# Altium project SCH-29364_a.PrjPcb (part 3 of 3)

## Sheet X-02 IOMUX.SchDoc
size 513 x 386 mm
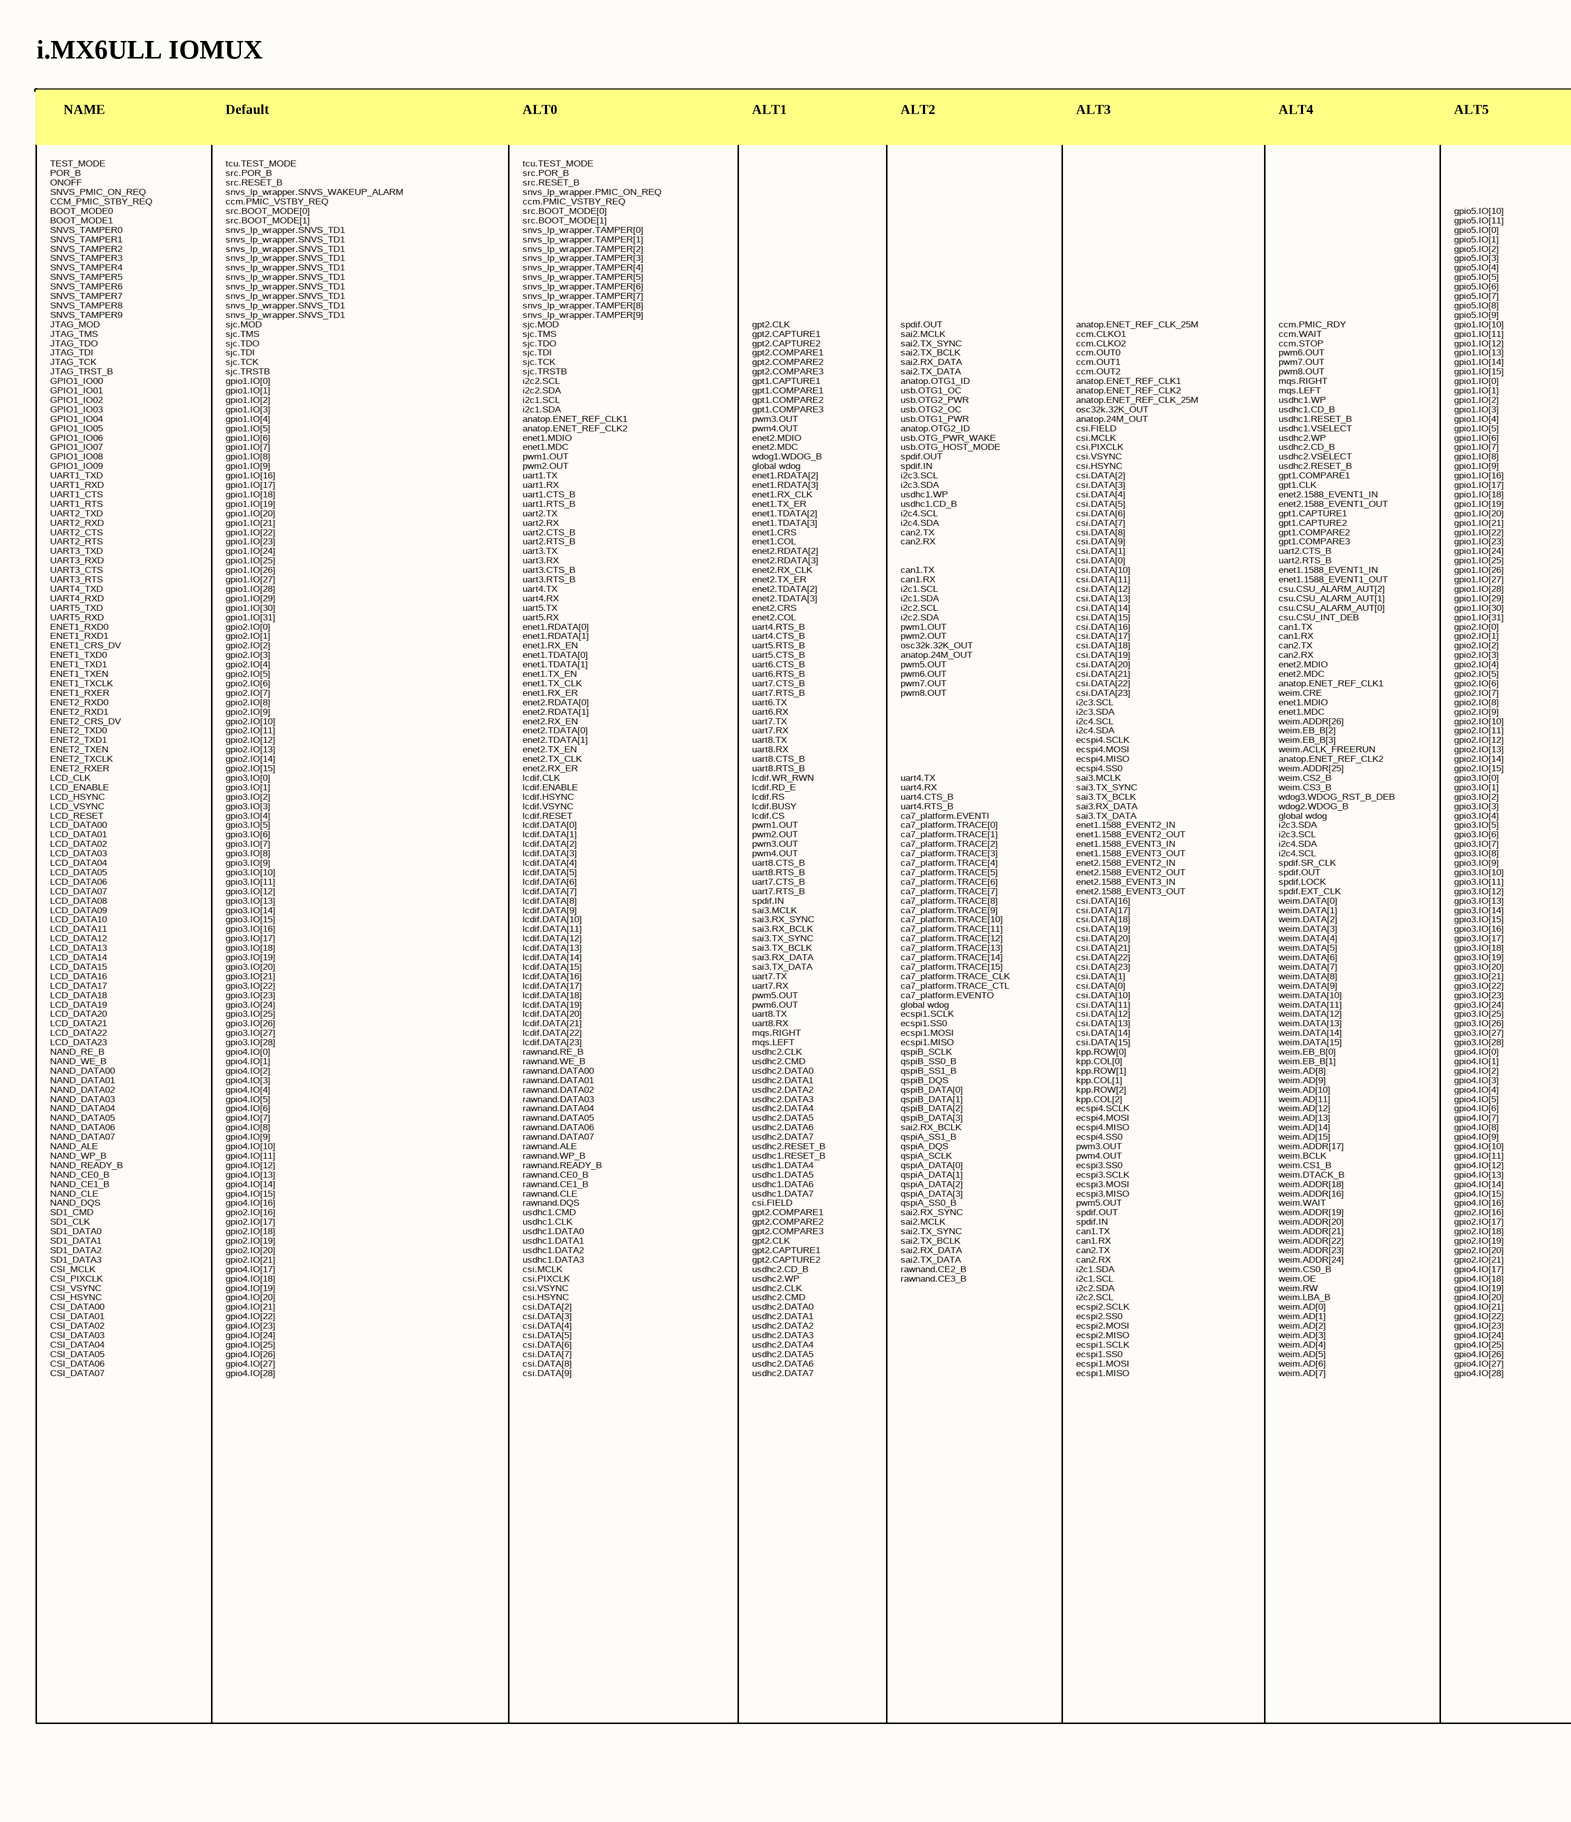
[diagram p20: X-02 IOMUX.SchDoc, left]
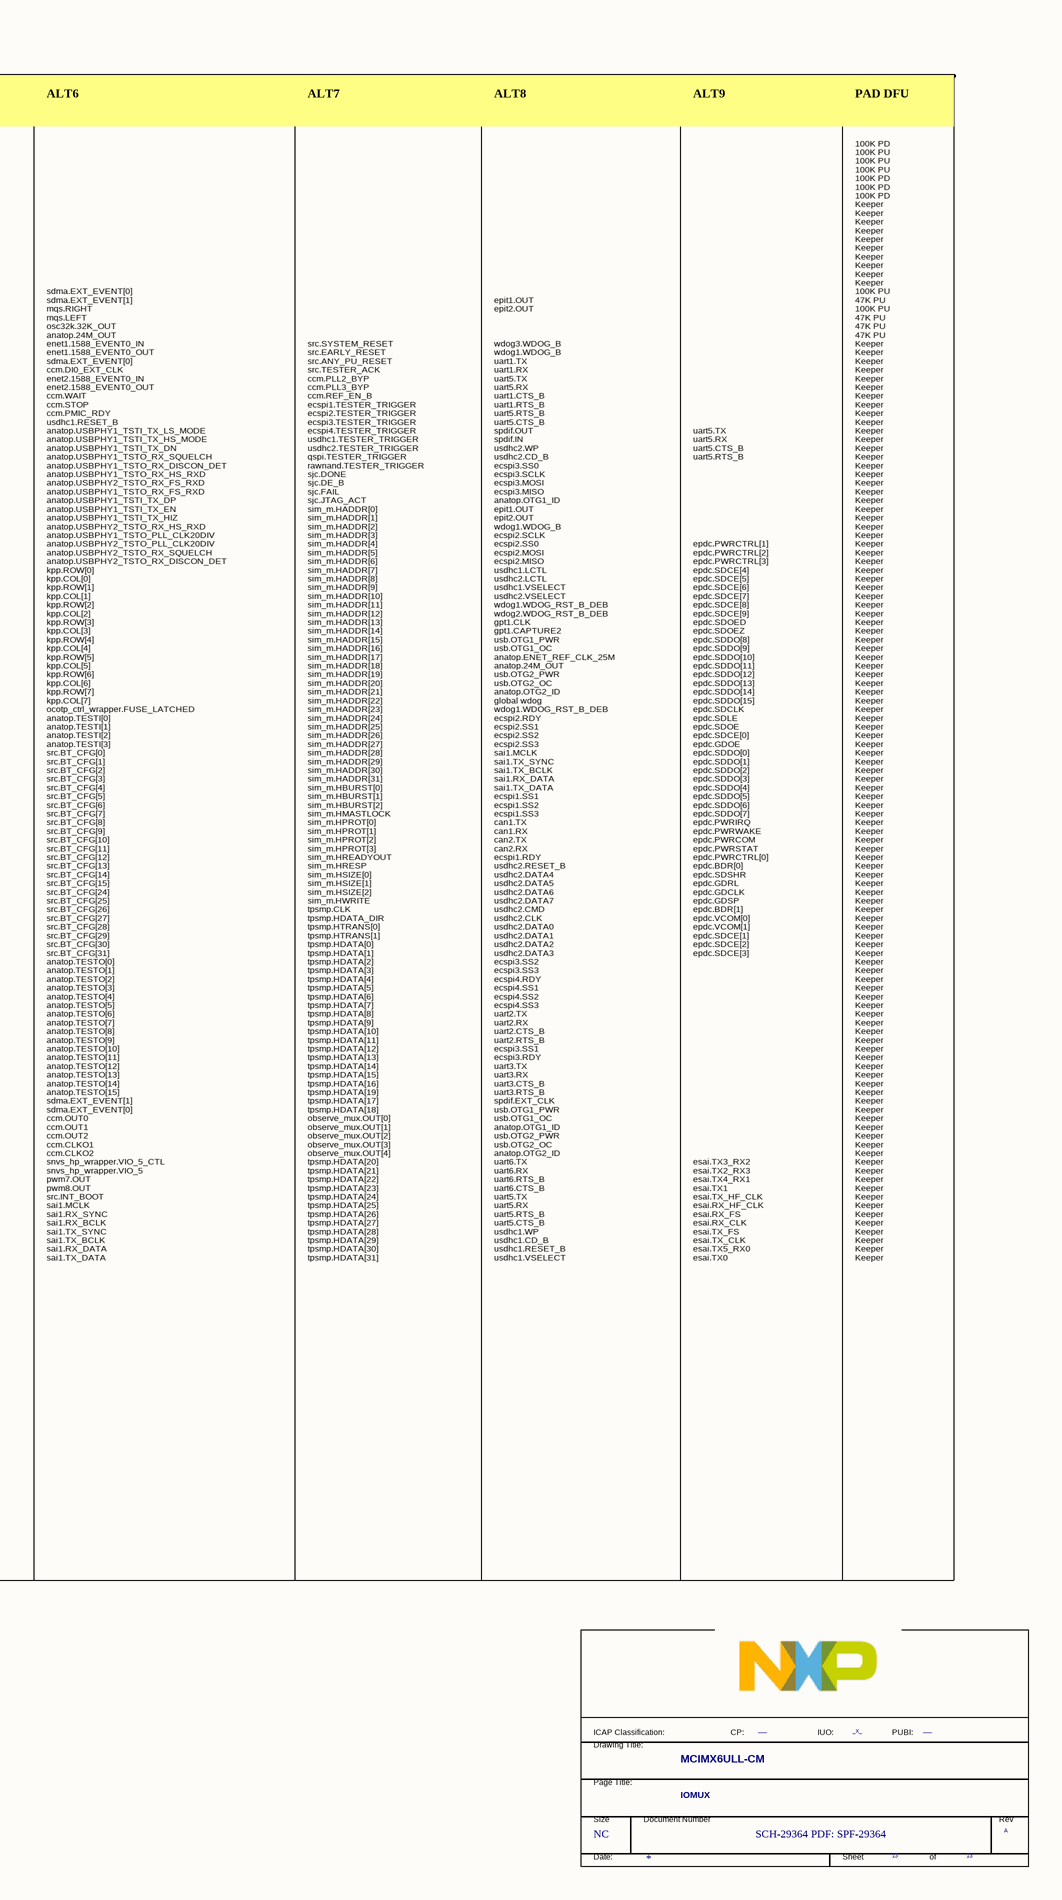
[diagram p21: X-02 IOMUX.SchDoc, right]

### Parts
(Parts that share a designator on the sheet are numbered #1, #2 ... from top to bottom, then left to right.)
*#12  FIUO: _X_  PUBI: ___  Doc: SCH-29364 PDF: SPF-29364  RevCode: A  Title: MCIMX6ULL-CM  Page Size: NC  Page Number: 13  PageTitle: IOMUX  (hidden comment: TitleBlock_FS)  (graphical)

### Notes on the sheet
- i.MX6ULL IOMUX
- NAME
- Default
- ALT0
- ALT1
- ALT2
- ALT3
- ALT4
- ALT5
- ALT6
- ALT7
- ALT8
- ALT9
- PAD DFU
- TEST_MODE
  POR_B
  ONOFF
  SNVS_PMIC_ON_REQ
  CCM_PMIC_STBY_REQ
  BOOT_MODE0
  BOOT_MODE1
  SNVS_TAMPER0
  SNVS_TAMPER1
  SNVS_TAMPER2
  SNVS_TAMPER3
  SNVS_TAMPER4
  SNVS_TAMPER5
  SNVS_TAMPER6
  SNVS_TAMPER7
  SNVS_TAMPER8
  SNVS_TAMPER9
  JTAG_MOD
  JTAG_TMS
  JTAG_TDO
  JTAG_TDI
  JTAG_TCK
  JTAG_TRST_B
  GPIO1_IO00
  GPIO1_IO01
  GPIO1_IO02
  GPIO1_IO03
  GPIO1_IO04
  GPIO1_IO05
  GPIO1_IO06
  GPIO1_IO07
  GPIO1_IO08
  GPIO1_IO09
  UART1_TXD
  UART1_RXD
  UART1_CTS
  UART1_RTS
  UART2_TXD
  UART2_RXD
  UART2_CTS
  UART2_RTS
  UART3_TXD
  UART3_RXD
  UART3_CTS
  UART3_RTS
  UART4_TXD
  UART4_RXD
  UART5_TXD
  UART5_RXD
  ENET1_RXD0
  ENET1_RXD1
  ENET1_CRS_DV
  ENET1_TXD0
  ENET1_TXD1
  ENET1_TXEN
  ENET1_TXCLK
  ENET1_RXER
  ENET2_RXD0
  ENET2_RXD1
  ENET2_CRS_DV
  ENET2_TXD0
  ENET2_TXD1
  ENET2_TXEN
  ENET2_TXCLK
  ENET2_RXER
  LCD_CLK
  LCD_ENABLE
  LCD_HSYNC
  LCD_VSYNC
  LCD_RESET
  LCD_DATA00
  LCD_DATA01
  LCD_DATA02
  LCD_DATA03
  LCD_DATA04
  LCD_DATA05
  LCD_DATA06
  LCD_DATA07
  LCD_DATA08
  LCD_DATA09
  LCD_DATA10
  LCD_DATA11
  LCD_DATA12
  LCD_DATA13
  LCD_DATA14
  LCD_DATA15
  LCD_DATA16
  LCD_DATA17
  LCD_DATA18
  LCD_DATA19
  LCD_DATA20
  LCD_DATA21
  LCD_DATA22
  LCD_DATA23
  NAND_RE_B
  NAND_WE_B
  NAND_DATA00
  NAND_DATA01
  NAND_DATA02
  NAND_DATA03
  NAND_DATA04
  NAND_DATA05
  NAND_DATA06
  NAND_DATA07
  NAND_ALE
  NAND_WP_B
  NAND_READY_B
  NAND_CE0_B
  NAND_CE1_B
  NAND_CLE
  NAND_DQS
  SD1_CMD
  SD1_CLK
  SD1_DATA0
  SD1_DATA1
  SD1_DATA2
  SD1_DATA3
  CSI_MCLK
  CSI_PIXCLK
  CSI_VSYNC
  CSI_HSYNC
  CSI_DATA00
  CSI_DATA01
  CSI_DATA02
  CSI_DATA03
  CSI_DATA04
  CSI_DATA05
  CSI_DATA06
  CSI_DATA07
- tcu.TEST_MODE
  src.POR_B
  src.RESET_B
  snvs_lp_wrapper.SNVS_WAKEUP_ALARM
  ccm.PMIC_VSTBY_REQ
  src.BOOT_MODE[0]
  src.BOOT_MODE[1]
  snvs_lp_wrapper.SNVS_TD1
  snvs_lp_wrapper.SNVS_TD1
  snvs_lp_wrapper.SNVS_TD1
  snvs_lp_wrapper.SNVS_TD1
  snvs_lp_wrapper.SNVS_TD1
  snvs_lp_wrapper.SNVS_TD1
  snvs_lp_wrapper.SNVS_TD1
  snvs_lp_wrapper.SNVS_TD1
  snvs_lp_wrapper.SNVS_TD1
  snvs_lp_wrapper.SNVS_TD1
  sjc.MOD
  sjc.TMS
  sjc.TDO
  sjc.TDI
  sjc.TCK
  sjc.TRSTB
  gpio1.IO[0]
  gpio1.IO[1]
  gpio1.IO[2]
  gpio1.IO[3]
  gpio1.IO[4]
  gpio1.IO[5]
  gpio1.IO[6]
  gpio1.IO[7]
  gpio1.IO[8]
  gpio1.IO[9]
  gpio1.IO[16]
  gpio1.IO[17]
  gpio1.IO[18]
  gpio1.IO[19]
  gpio1.IO[20]
  gpio1.IO[21]
  gpio1.IO[22]
  gpio1.IO[23]
  gpio1.IO[24]
  gpio1.IO[25]
  gpio1.IO[26]
  gpio1.IO[27]
  gpio1.IO[28]
  gpio1.IO[29]
  gpio1.IO[30]
  gpio1.IO[31]
  gpio2.IO[0]
  gpio2.IO[1]
  gpio2.IO[2]
  gpio2.IO[3]
  gpio2.IO[4]
  gpio2.IO[5]
  gpio2.IO[6]
  gpio2.IO[7]
  gpio2.IO[8]
  gpio2.IO[9]
  gpio2.IO[10]
  gpio2.IO[11]
  gpio2.IO[12]
  gpio2.IO[13]
  gpio2.IO[14]
  gpio2.IO[15]
  gpio3.IO[0]
  gpio3.IO[1]
  gpio3.IO[2]
  gpio3.IO[3]
  gpio3.IO[4]
  gpio3.IO[5]
  gpio3.IO[6]
  gpio3.IO[7]
  gpio3.IO[8]
  gpio3.IO[9]
  gpio3.IO[10]
  gpio3.IO[11]
  gpio3.IO[12]
  gpio3.IO[13]
  gpio3.IO[14]
  gpio3.IO[15]
  gpio3.IO[16]
  gpio3.IO[17]
  gpio3.IO[18]
  gpio3.IO[19]
  gpio3.IO[20]
  gpio3.IO[21]
  gpio3.IO[22]
  gpio3.IO[23]
  gpio3.IO[24]
  gpio3.IO[25]
  gpio3.IO[26]
  gpio3.IO[27]
  gpio3.IO[28]
  gpio4.IO[0]
  gpio4.IO[1]
  gpio4.IO[2]
  gpio4.IO[3]
  gpio4.IO[4]
  gpio4.IO[5]
  gpio4.IO[6]
  gpio4.IO[7]
  gpio4.IO[8]
  gpio4.IO[9]
  gpio4.IO[10]
  gpio4.IO[11]
  gpio4.IO[12]
  gpio4.IO[13]
  gpio4.IO[14]
  gpio4.IO[15]
  gpio4.IO[16]
  gpio2.IO[16]
  gpio2.IO[17]
  gpio2.IO[18]
  gpio2.IO[19]
  gpio2.IO[20]
  gpio2.IO[21]
  gpio4.IO[17]
  gpio4.IO[18]
  gpio4.IO[19]
  gpio4.IO[20]
  gpio4.IO[21]
  gpio4.IO[22]
  gpio4.IO[23]
  gpio4.IO[24]
  gpio4.IO[25]
  gpio4.IO[26]
  gpio4.IO[27]
  gpio4.IO[28]
- tcu.TEST_MODE
  src.POR_B
  src.RESET_B
  snvs_lp_wrapper.PMIC_ON_REQ
  ccm.PMIC_VSTBY_REQ
  src.BOOT_MODE[0]
  src.BOOT_MODE[1]
  snvs_lp_wrapper.TAMPER[0]
  snvs_lp_wrapper.TAMPER[1]
  snvs_lp_wrapper.TAMPER[2]
  snvs_lp_wrapper.TAMPER[3]
  snvs_lp_wrapper.TAMPER[4]
  snvs_lp_wrapper.TAMPER[5]
  snvs_lp_wrapper.TAMPER[6]
  snvs_lp_wrapper.TAMPER[7]
  snvs_lp_wrapper.TAMPER[8]
  snvs_lp_wrapper.TAMPER[9]
  sjc.MOD
  sjc.TMS
  sjc.TDO
  sjc.TDI
  sjc.TCK
  sjc.TRSTB
  i2c2.SCL
  i2c2.SDA
  i2c1.SCL
  i2c1.SDA
  anatop.ENET_REF_CLK1
  anatop.ENET_REF_CLK2
  enet1.MDIO
  enet1.MDC
  pwm1.OUT
  pwm2.OUT
  uart1.TX
  uart1.RX
  uart1.CTS_B
  uart1.RTS_B
  uart2.TX
  uart2.RX
  uart2.CTS_B
  uart2.RTS_B
  uart3.TX
  uart3.RX
  uart3.CTS_B
  uart3.RTS_B
  uart4.TX
  uart4.RX
  uart5.TX
  uart5.RX
  enet1.RDATA[0]
  enet1.RDATA[1]
  enet1.RX_EN
  enet1.TDATA[0]
  enet1.TDATA[1]
  enet1.TX_EN
  enet1.TX_CLK
  enet1.RX_ER
  enet2.RDATA[0]
  enet2.RDATA[1]
  enet2.RX_EN
  enet2.TDATA[0]
  enet2.TDATA[1]
  enet2.TX_EN
  enet2.TX_CLK
  enet2.RX_ER
  lcdif.CLK
  lcdif.ENABLE
  lcdif.HSYNC
  lcdif.VSYNC
  lcdif.RESET
  lcdif.DATA[0]
  lcdif.DATA[1]
  lcdif.DATA[2]
  lcdif.DATA[3]
  lcdif.DATA[4]
  lcdif.DATA[5]
  lcdif.DATA[6]
  lcdif.DATA[7]
  lcdif.DATA[8]
  lcdif.DATA[9]
  lcdif.DATA[10]
  lcdif.DATA[11]
  lcdif.DATA[12]
  lcdif.DATA[13]
  lcdif.DATA[14]
  lcdif.DATA[15]
  lcdif.DATA[16]
  lcdif.DATA[17]
  lcdif.DATA[18]
  lcdif.DATA[19]
  lcdif.DATA[20]
  lcdif.DATA[21]
  lcdif.DATA[22]
  lcdif.DATA[23]
  rawnand.RE_B
  rawnand.WE_B
  rawnand.DATA00
  rawnand.DATA01
  rawnand.DATA02
  rawnand.DATA03
  rawnand.DATA04
  rawnand.DATA05
  rawnand.DATA06
  rawnand.DATA07
  rawnand.ALE
  rawnand.WP_B
  rawnand.READY_B
  rawnand.CE0_B
  rawnand.CE1_B
  rawnand.CLE
  rawnand.DQS
  usdhc1.CMD
  usdhc1.CLK
  usdhc1.DATA0
  usdhc1.DATA1
  usdhc1.DATA2
  usdhc1.DATA3
  csi.MCLK
  csi.PIXCLK
  csi.VSYNC
  csi.HSYNC
  csi.DATA[2]
  csi.DATA[3]
  csi.DATA[4]
  csi.DATA[5]
  csi.DATA[6]
  csi.DATA[7]
  csi.DATA[8]
  csi.DATA[9]
- gpt2.CLK
  gpt2.CAPTURE1
  gpt2.CAPTURE2
  gpt2.COMPARE1
  gpt2.COMPARE2
  gpt2.COMPARE3
  gpt1.CAPTURE1
  gpt1.COMPARE1
  gpt1.COMPARE2
  gpt1.COMPARE3
  pwm3.OUT
  pwm4.OUT
  enet2.MDIO
  enet2.MDC
  wdog1.WDOG_B
  global wdog
  enet1.RDATA[2]
  enet1.RDATA[3]
  enet1.RX_CLK
  enet1.TX_ER
  enet1.TDATA[2]
  enet1.TDATA[3]
  enet1.CRS
  enet1.COL
  enet2.RDATA[2]
  enet2.RDATA[3]
  enet2.RX_CLK
  enet2.TX_ER
  enet2.TDATA[2]
  enet2.TDATA[3]
  enet2.CRS
  enet2.COL
  uart4.RTS_B
  uart4.CTS_B
  uart5.RTS_B
  uart5.CTS_B
  uart6.CTS_B
  uart6.RTS_B
  uart7.CTS_B
  uart7.RTS_B
  uart6.TX
  uart6.RX
  uart7.TX
  uart7.RX
  uart8.TX
  uart8.RX
  uart8.CTS_B
  uart8.RTS_B
  lcdif.WR_RWN
  lcdif.RD_E
  lcdif.RS
  lcdif.BUSY
  lcdif.CS
  pwm1.OUT
  pwm2.OUT
  pwm3.OUT
  pwm4.OUT
  uart8.CTS_B
  uart8.RTS_B
  uart7.CTS_B
  uart7.RTS_B
  spdif.IN
  sai3.MCLK
  sai3.RX_SYNC
  sai3.RX_BCLK
  sai3.TX_SYNC
  sai3.TX_BCLK
  sai3.RX_DATA
  sai3.TX_DATA
  uart7.TX
  uart7.RX
  pwm5.OUT
  pwm6.OUT
  uart8.TX
  uart8.RX
  mqs.RIGHT
  mqs.LEFT
  usdhc2.CLK
  usdhc2.CMD
  usdhc2.DATA0
  usdhc2.DATA1
  usdhc2.DATA2
  usdhc2.DATA3
  usdhc2.DATA4
  usdhc2.DATA5
  usdhc2.DATA6
  usdhc2.DATA7
  usdhc2.RESET_B
  usdhc1.RESET_B
  usdhc1.DATA4
  usdhc1.DATA5
  usdhc1.DATA6
  usdhc1.DATA7
  csi.FIELD
  gpt2.COMPARE1
  gpt2.COMPARE2
  gpt2.COMPARE3
  gpt2.CLK
  gpt2.CAPTURE1
  gpt2.CAPTURE2
  usdhc2.CD_B
  usdhc2.WP
  usdhc2.CLK
  usdhc2.CMD
  usdhc2.DATA0
  usdhc2.DATA1
  usdhc2.DATA2
  usdhc2.DATA3
  usdhc2.DATA4
  usdhc2.DATA5
  usdhc2.DATA6
  usdhc2.DATA7
- spdif.OUT
  sai2.MCLK
  sai2.TX_SYNC
  sai2.TX_BCLK
  sai2.RX_DATA
  sai2.TX_DATA
  anatop.OTG1_ID
  usb.OTG1_OC
  usb.OTG2_PWR
  usb.OTG2_OC
  usb.OTG1_PWR
  anatop.OTG2_ID
  usb.OTG_PWR_WAKE
  usb.OTG_HOST_MODE
  spdif.OUT
  spdif.IN
  i2c3.SCL
  i2c3.SDA
  usdhc1.WP
  usdhc1.CD_B
  i2c4.SCL
  i2c4.SDA
  can2.TX
  can2.RX
  can1.TX
  can1.RX
  i2c1.SCL
  i2c1.SDA
  i2c2.SCL
  i2c2.SDA
  pwm1.OUT
  pwm2.OUT
  osc32k.32K_OUT
  anatop.24M_OUT
  pwm5.OUT
  pwm6.OUT
  pwm7.OUT
  pwm8.OUT
  uart4.TX
  uart4.RX
  uart4.CTS_B
  uart4.RTS_B
  ca7_platform.EVENTI
  ca7_platform.TRACE[0]
  ca7_platform.TRACE[1]
  ca7_platform.TRACE[2]
  ca7_platform.TRACE[3]
  ca7_platform.TRACE[4]
  ca7_platform.TRACE[5]
  ca7_platform.TRACE[6]
  ca7_platform.TRACE[7]
  ca7_platform.TRACE[8]
  ca7_platform.TRACE[9]
  ca7_platform.TRACE[10]
  ca7_platform.TRACE[11]
  ca7_platform.TRACE[12]
  ca7_platform.TRACE[13]
  ca7_platform.TRACE[14]
  ca7_platform.TRACE[15]
  ca7_platform.TRACE_CLK
  ca7_platform.TRACE_CTL
  ca7_platform.EVENTO
  global wdog
  ecspi1.SCLK
  ecspi1.SS0
  ecspi1.MOSI
  ecspi1.MISO
  qspiB_SCLK
  qspiB_SS0_B
  qspiB_SS1_B
  qspiB_DQS
  qspiB_DATA[0]
  qspiB_DATA[1]
  qspiB_DATA[2]
  qspiB_DATA[3]
  sai2.RX_BCLK
  qspiA_SS1_B
  qspiA_DQS
  qspiA_SCLK
  qspiA_DATA[0]
  qspiA_DATA[1]
  qspiA_DATA[2]
  qspiA_DATA[3]
  qspiA_SS0_B
  sai2.RX_SYNC
  sai2.MCLK
  sai2.TX_SYNC
  sai2.TX_BCLK
  sai2.RX_DATA
  sai2.TX_DATA
  rawnand.CE2_B
  rawnand.CE3_B
- anatop.ENET_REF_CLK_25M
  ccm.CLKO1
  ccm.CLKO2
  ccm.OUT0
  ccm.OUT1
  ccm.OUT2
  anatop.ENET_REF_CLK1
  anatop.ENET_REF_CLK2
  anatop.ENET_REF_CLK_25M
  osc32k.32K_OUT
  anatop.24M_OUT
  csi.FIELD
  csi.MCLK
  csi.PIXCLK
  csi.VSYNC
  csi.HSYNC
  csi.DATA[2]
  csi.DATA[3]
  csi.DATA[4]
  csi.DATA[5]
  csi.DATA[6]
  csi.DATA[7]
  csi.DATA[8]
  csi.DATA[9]
  csi.DATA[1]
  csi.DATA[0]
  csi.DATA[10]
  csi.DATA[11]
  csi.DATA[12]
  csi.DATA[13]
  csi.DATA[14]
  csi.DATA[15]
  csi.DATA[16]
  csi.DATA[17]
  csi.DATA[18]
  csi.DATA[19]
  csi.DATA[20]
  csi.DATA[21]
  csi.DATA[22]
  csi.DATA[23]
  i2c3.SCL
  i2c3.SDA
  i2c4.SCL
  i2c4.SDA
  ecspi4.SCLK
  ecspi4.MOSI
  ecspi4.MISO
  ecspi4.SS0
  sai3.MCLK
  sai3.TX_SYNC
  sai3.TX_BCLK
  sai3.RX_DATA
  sai3.TX_DATA
  enet1.1588_EVENT2_IN
  enet1.1588_EVENT2_OUT
  enet1.1588_EVENT3_IN
  enet1.1588_EVENT3_OUT
  enet2.1588_EVENT2_IN
  enet2.1588_EVENT2_OUT
  enet2.1588_EVENT3_IN
  enet2.1588_EVENT3_OUT
  csi.DATA[16]
  csi.DATA[17]
  csi.DATA[18]
  csi.DATA[19]
  csi.DATA[20]
  csi.DATA[21]
  csi.DATA[22]
  csi.DATA[23]
  csi.DATA[1]
  csi.DATA[0]
  csi.DATA[10]
  csi.DATA[11]
  csi.DATA[12]
  csi.DATA[13]
  csi.DATA[14]
  csi.DATA[15]
  kpp.ROW[0]
  kpp.COL[0]
  kpp.ROW[1]
  kpp.COL[1]
  kpp.ROW[2]
  kpp.COL[2]
  ecspi4.SCLK
  ecspi4.MOSI
  ecspi4.MISO
  ecspi4.SS0
  pwm3.OUT
  pwm4.OUT
  ecspi3.SS0
  ecspi3.SCLK
  ecspi3.MOSI
  ecspi3.MISO
  pwm5.OUT
  spdif.OUT
  spdif.IN
  can1.TX
  can1.RX
  can2.TX
  can2.RX
  i2c1.SDA
  i2c1.SCL
  i2c2.SDA
  i2c2.SCL
  ecspi2.SCLK
  ecspi2.SS0
  ecspi2.MOSI
  ecspi2.MISO
  ecspi1.SCLK
  ecspi1.SS0
  ecspi1.MOSI
  ecspi1.MISO
- ccm.PMIC_RDY
  ccm.WAIT
  ccm.STOP
  pwm6.OUT
  pwm7.OUT
  pwm8.OUT
  mqs.RIGHT
  mqs.LEFT
  usdhc1.WP
  usdhc1.CD_B
  usdhc1.RESET_B
  usdhc1.VSELECT
  usdhc2.WP
  usdhc2.CD_B
  usdhc2.VSELECT
  usdhc2.RESET_B
  gpt1.COMPARE1
  gpt1.CLK
  enet2.1588_EVENT1_IN
  enet2.1588_EVENT1_OUT
  gpt1.CAPTURE1
  gpt1.CAPTURE2
  gpt1.COMPARE2
  gpt1.COMPARE3
  uart2.CTS_B
  uart2.RTS_B
  enet1.1588_EVENT1_IN
  enet1.1588_EVENT1_OUT
  csu.CSU_ALARM_AUT[2]
  csu.CSU_ALARM_AUT[1]
  csu.CSU_ALARM_AUT[0]
  csu.CSU_INT_DEB
  can1.TX
  can1.RX
  can2.TX
  can2.RX
  enet2.MDIO
  enet2.MDC
  anatop.ENET_REF_CLK1
  weim.CRE
  enet1.MDIO
  enet1.MDC
  weim.ADDR[26]
  weim.EB_B[2]
  weim.EB_B[3]
  weim.ACLK_FREERUN
  anatop.ENET_REF_CLK2
  weim.ADDR[25]
  weim.CS2_B
  weim.CS3_B
  wdog3.WDOG_RST_B_DEB
  wdog2.WDOG_B
  global wdog
  i2c3.SDA
  i2c3.SCL
  i2c4.SDA
  i2c4.SCL
  spdif.SR_CLK
  spdif.OUT
  spdif.LOCK
  spdif.EXT_CLK
  weim.DATA[0]
  weim.DATA[1]
  weim.DATA[2]
  weim.DATA[3]
  weim.DATA[4]
  weim.DATA[5]
  weim.DATA[6]
  weim.DATA[7]
  weim.DATA[8]
  weim.DATA[9]
  weim.DATA[10]
  weim.DATA[11]
  weim.DATA[12]
  weim.DATA[13]
  weim.DATA[14]
  weim.DATA[15]
  weim.EB_B[0]
  weim.EB_B[1]
  weim.AD[8]
  weim.AD[9]
  weim.AD[10]
  weim.AD[11]
  weim.AD[12]
  weim.AD[13]
  weim.AD[14]
  weim.AD[15]
  weim.ADDR[17]
  weim.BCLK
  weim.CS1_B
  weim.DTACK_B
  weim.ADDR[18]
  weim.ADDR[16]
  weim.WAIT
  weim.ADDR[19]
  weim.ADDR[20]
  weim.ADDR[21]
  weim.ADDR[22]
  weim.ADDR[23]
  weim.ADDR[24]
  weim.CS0_B
  weim.OE
  weim.RW
  weim.LBA_B
  weim.AD[0]
  weim.AD[1]
  weim.AD[2]
  weim.AD[3]
  weim.AD[4]
  weim.AD[5]
  weim.AD[6]
  weim.AD[7]
- gpio5.IO[10]
  gpio5.IO[11]
  gpio5.IO[0]
  gpio5.IO[1]
  gpio5.IO[2]
  gpio5.IO[3]
  gpio5.IO[4]
  gpio5.IO[5]
  gpio5.IO[6]
  gpio5.IO[7]
  gpio5.IO[8]
  gpio5.IO[9]
  gpio1.IO[10]
  gpio1.IO[11]
  gpio1.IO[12]
  gpio1.IO[13]
  gpio1.IO[14]
  gpio1.IO[15]
  gpio1.IO[0]
  gpio1.IO[1]
  gpio1.IO[2]
  gpio1.IO[3]
  gpio1.IO[4]
  gpio1.IO[5]
  gpio1.IO[6]
  gpio1.IO[7]
  gpio1.IO[8]
  gpio1.IO[9]
  gpio1.IO[16]
  gpio1.IO[17]
  gpio1.IO[18]
  gpio1.IO[19]
  gpio1.IO[20]
  gpio1.IO[21]
  gpio1.IO[22]
  gpio1.IO[23]
  gpio1.IO[24]
  gpio1.IO[25]
  gpio1.IO[26]
  gpio1.IO[27]
  gpio1.IO[28]
  gpio1.IO[29]
  gpio1.IO[30]
  gpio1.IO[31]
  gpio2.IO[0]
  gpio2.IO[1]
  gpio2.IO[2]
  gpio2.IO[3]
  gpio2.IO[4]
  gpio2.IO[5]
  gpio2.IO[6]
  gpio2.IO[7]
  gpio2.IO[8]
  gpio2.IO[9]
  gpio2.IO[10]
  gpio2.IO[11]
  gpio2.IO[12]
  gpio2.IO[13]
  gpio2.IO[14]
  gpio2.IO[15]
  gpio3.IO[0]
  gpio3.IO[1]
  gpio3.IO[2]
  gpio3.IO[3]
  gpio3.IO[4]
  gpio3.IO[5]
  gpio3.IO[6]
  gpio3.IO[7]
  gpio3.IO[8]
  gpio3.IO[9]
  gpio3.IO[10]
  gpio3.IO[11]
  gpio3.IO[12]
  gpio3.IO[13]
  gpio3.IO[14]
  gpio3.IO[15]
  gpio3.IO[16]
  gpio3.IO[17]
  gpio3.IO[18]
  gpio3.IO[19]
  gpio3.IO[20]
  gpio3.IO[21]
  gpio3.IO[22]
  gpio3.IO[23]
  gpio3.IO[24]
  gpio3.IO[25]
  gpio3.IO[26]
  gpio3.IO[27]
  gpio3.IO[28]
  gpio4.IO[0]
  gpio4.IO[1]
  gpio4.IO[2]
  gpio4.IO[3]
  gpio4.IO[4]
  gpio4.IO[5]
  gpio4.IO[6]
  gpio4.IO[7]
  gpio4.IO[8]
  gpio4.IO[9]
  gpio4.IO[10]
  gpio4.IO[11]
  gpio4.IO[12]
  gpio4.IO[13]
  gpio4.IO[14]
  gpio4.IO[15]
  gpio4.IO[16]
  gpio2.IO[16]
  gpio2.IO[17]
  gpio2.IO[18]
  gpio2.IO[19]
  gpio2.IO[20]
  gpio2.IO[21]
  gpio4.IO[17]
  gpio4.IO[18]
  gpio4.IO[19]
  gpio4.IO[20]
  gpio4.IO[21]
  gpio4.IO[22]
  gpio4.IO[23]
  gpio4.IO[24]
  gpio4.IO[25]
  gpio4.IO[26]
  gpio4.IO[27]
  gpio4.IO[28]
- sdma.EXT_EVENT[0]
  sdma.EXT_EVENT[1]
  mqs.RIGHT
  mqs.LEFT
  osc32k.32K_OUT
  anatop.24M_OUT
  enet1.1588_EVENT0_IN
  enet1.1588_EVENT0_OUT
  sdma.EXT_EVENT[0]
  ccm.DI0_EXT_CLK
  enet2.1588_EVENT0_IN
  enet2.1588_EVENT0_OUT
  ccm.WAIT
  ccm.STOP
  ccm.PMIC_RDY
  usdhc1.RESET_B
  anatop.USBPHY1_TSTI_TX_LS_MODE
  anatop.USBPHY1_TSTI_TX_HS_MODE
  anatop.USBPHY1_TSTI_TX_DN
  anatop.USBPHY1_TSTO_RX_SQUELCH
  anatop.USBPHY1_TSTO_RX_DISCON_DET
  anatop.USBPHY1_TSTO_RX_HS_RXD
  anatop.USBPHY2_TSTO_RX_FS_RXD
  anatop.USBPHY1_TSTO_RX_FS_RXD
  anatop.USBPHY1_TSTI_TX_DP
  anatop.USBPHY1_TSTI_TX_EN
  anatop.USBPHY1_TSTI_TX_HIZ
  anatop.USBPHY2_TSTO_RX_HS_RXD
  anatop.USBPHY1_TSTO_PLL_CLK20DIV
  anatop.USBPHY2_TSTO_PLL_CLK20DIV
  anatop.USBPHY2_TSTO_RX_SQUELCH
  anatop.USBPHY2_TSTO_RX_DISCON_DET
  kpp.ROW[0]
  kpp.COL[0]
  kpp.ROW[1]
  kpp.COL[1]
  kpp.ROW[2]
  kpp.COL[2]
  kpp.ROW[3]
  kpp.COL[3]
  kpp.ROW[4]
  kpp.COL[4]
  kpp.ROW[5]
  kpp.COL[5]
  kpp.ROW[6]
  kpp.COL[6]
  kpp.ROW[7]
  kpp.COL[7]
  ocotp_ctrl_wrapper.FUSE_LATCHED
  anatop.TESTI[0]
  anatop.TESTI[1]
  anatop.TESTI[2]
  anatop.TESTI[3]
  src.BT_CFG[0]
  src.BT_CFG[1]
  src.BT_CFG[2]
  src.BT_CFG[3]
  src.BT_CFG[4]
  src.BT_CFG[5]
  src.BT_CFG[6]
  src.BT_CFG[7]
  src.BT_CFG[8]
  src.BT_CFG[9]
  src.BT_CFG[10]
  src.BT_CFG[11]
  src.BT_CFG[12]
  src.BT_CFG[13]
  src.BT_CFG[14]
  src.BT_CFG[15]
  src.BT_CFG[24]
  src.BT_CFG[25]
  src.BT_CFG[26]
  src.BT_CFG[27]
  src.BT_CFG[28]
  src.BT_CFG[29]
  src.BT_CFG[30]
  src.BT_CFG[31]
  anatop.TESTO[0]
  anatop.TESTO[1]
  anatop.TESTO[2]
  anatop.TESTO[3]
  anatop.TESTO[4]
  anatop.TESTO[5]
  anatop.TESTO[6]
  anatop.TESTO[7]
  anatop.TESTO[8]
  anatop.TESTO[9]
  anatop.TESTO[10]
  anatop.TESTO[11]
  anatop.TESTO[12]
  anatop.TESTO[13]
  anatop.TESTO[14]
  anatop.TESTO[15]
  sdma.EXT_EVENT[1]
  sdma.EXT_EVENT[0]
  ccm.OUT0
  ccm.OUT1
  ccm.OUT2
  ccm.CLKO1
  ccm.CLKO2
  snvs_hp_wrapper.VIO_5_CTL
  snvs_hp_wrapper.VIO_5
  pwm7.OUT
  pwm8.OUT
  src.INT_BOOT
  sai1.MCLK
  sai1.RX_SYNC
  sai1.RX_BCLK
  sai1.TX_SYNC
  sai1.TX_BCLK
  sai1.RX_DATA
  sai1.TX_DATA
- src.SYSTEM_RESET
  src.EARLY_RESET
  src.ANY_PU_RESET
  src.TESTER_ACK
  ccm.PLL2_BYP
  ccm.PLL3_BYP
  ccm.REF_EN_B
  ecspi1.TESTER_TRIGGER
  ecspi2.TESTER_TRIGGER
  ecspi3.TESTER_TRIGGER
  ecspi4.TESTER_TRIGGER
  usdhc1.TESTER_TRIGGER
  usdhc2.TESTER_TRIGGER
  qspi.TESTER_TRIGGER
  rawnand.TESTER_TRIGGER
  sjc.DONE
  sjc.DE_B
  sjc.FAIL
  sjc.JTAG_ACT
  sim_m.HADDR[0]
  sim_m.HADDR[1]
  sim_m.HADDR[2]
  sim_m.HADDR[3]
  sim_m.HADDR[4]
  sim_m.HADDR[5]
  sim_m.HADDR[6]
  sim_m.HADDR[7]
  sim_m.HADDR[8]
  sim_m.HADDR[9]
  sim_m.HADDR[10]
  sim_m.HADDR[11]
  sim_m.HADDR[12]
  sim_m.HADDR[13]
  sim_m.HADDR[14]
  sim_m.HADDR[15]
  sim_m.HADDR[16]
  sim_m.HADDR[17]
  sim_m.HADDR[18]
  sim_m.HADDR[19]
  sim_m.HADDR[20]
  sim_m.HADDR[21]
  sim_m.HADDR[22]
  sim_m.HADDR[23]
  sim_m.HADDR[24]
  sim_m.HADDR[25]
  sim_m.HADDR[26]
  sim_m.HADDR[27]
  sim_m.HADDR[28]
  sim_m.HADDR[29]
  sim_m.HADDR[30]
  sim_m.HADDR[31]
  sim_m.HBURST[0]
  sim_m.HBURST[1]
  sim_m.HBURST[2]
  sim_m.HMASTLOCK
  sim_m.HPROT[0]
  sim_m.HPROT[1]
  sim_m.HPROT[2]
  sim_m.HPROT[3]
  sim_m.HREADYOUT
  sim_m.HRESP
  sim_m.HSIZE[0]
  sim_m.HSIZE[1]
  sim_m.HSIZE[2]
  sim_m.HWRITE
  tpsmp.CLK
  tpsmp.HDATA_DIR
  tpsmp.HTRANS[0]
  tpsmp.HTRANS[1]
  tpsmp.HDATA[0]
  tpsmp.HDATA[1]
  tpsmp.HDATA[2]
  tpsmp.HDATA[3]
  tpsmp.HDATA[4]
  tpsmp.HDATA[5]
  tpsmp.HDATA[6]
  tpsmp.HDATA[7]
  tpsmp.HDATA[8]
  tpsmp.HDATA[9]
  tpsmp.HDATA[10]
  tpsmp.HDATA[11]
  tpsmp.HDATA[12]
  tpsmp.HDATA[13]
  tpsmp.HDATA[14]
  tpsmp.HDATA[15]
  tpsmp.HDATA[16]
  tpsmp.HDATA[19]
  tpsmp.HDATA[17]
  tpsmp.HDATA[18]
  observe_mux.OUT[0]
  observe_mux.OUT[1]
  observe_mux.OUT[2]
  observe_mux.OUT[3]
  observe_mux.OUT[4]
  tpsmp.HDATA[20]
  tpsmp.HDATA[21]
  tpsmp.HDATA[22]
  tpsmp.HDATA[23]
  tpsmp.HDATA[24]
  tpsmp.HDATA[25]
  tpsmp.HDATA[26]
  tpsmp.HDATA[27]
  tpsmp.HDATA[28]
  tpsmp.HDATA[29]
  tpsmp.HDATA[30]
  tpsmp.HDATA[31]
- (near *#12) epit1.OUT
  epit2.OUT
  wdog3.WDOG_B
  wdog1.WDOG_B
  uart1.TX
  uart1.RX
  uart5.TX
  uart5.RX
  uart1.CTS_B
  uart1.RTS_B
  uart5.RTS_B
  uart5.CTS_B
  spdif.OUT
  spdif.IN
  usdhc2.WP
  usdhc2.CD_B
  ecspi3.SS0
  ecspi3.SCLK
  ecspi3.MOSI
  ecspi3.MISO
  anatop.OTG1_ID
  epit1.OUT
  epit2.OUT
  wdog1.WDOG_B
  ecspi2.SCLK
  ecspi2.SS0
  ecspi2.MOSI
  ecspi2.MISO
  usdhc1.LCTL
  usdhc2.LCTL
  usdhc1.VSELECT
  usdhc2.VSELECT
  wdog1.WDOG_RST_B_DEB
  wdog2.WDOG_RST_B_DEB
  gpt1.CLK
  gpt1.CAPTURE2
  usb.OTG1_PWR
  usb.OTG1_OC
  anatop.ENET_REF_CLK_25M
  anatop.24M_OUT
  usb.OTG2_PWR
  usb.OTG2_OC
  anatop.OTG2_ID
  global wdog
  wdog1.WDOG_RST_B_DEB
  ecspi2.RDY
  ecspi2.SS1
  ecspi2.SS2
  ecspi2.SS3
  sai1.MCLK
  sai1.TX_SYNC
  sai1.TX_BCLK
  sai1.RX_DATA
  sai1.TX_DATA
  ecspi1.SS1
  ecspi1.SS2
  ecspi1.SS3
  can1.TX
  can1.RX
  can2.TX
  can2.RX
  ecspi1.RDY
  usdhc2.RESET_B
  usdhc2.DATA4
  usdhc2.DATA5
  usdhc2.DATA6
  usdhc2.DATA7
  usdhc2.CMD
  usdhc2.CLK
  usdhc2.DATA0
  usdhc2.DATA1
  usdhc2.DATA2
  usdhc2.DATA3
  ecspi3.SS2
  ecspi3.SS3
  ecspi4.RDY
  ecspi4.SS1
  ecspi4.SS2
  ecspi4.SS3
  uart2.TX
  uart2.RX
  uart2.CTS_B
  uart2.RTS_B
  ecspi3.SS1
  ecspi3.RDY
  uart3.TX
  uart3.RX
  uart3.CTS_B
  uart3.RTS_B
  spdif.EXT_CLK
  usb.OTG1_PWR
  usb.OTG1_OC
  anatop.OTG1_ID
  usb.OTG2_PWR
  usb.OTG2_OC
  anatop.OTG2_ID
  uart6.TX
  uart6.RX
  uart6.RTS_B
  uart6.CTS_B
  uart5.TX
  uart5.RX
  uart5.RTS_B
  uart5.CTS_B
  usdhc1.WP
  usdhc1.CD_B
  usdhc1.RESET_B
  usdhc1.VSELECT
- uart5.TX
  uart5.RX
  uart5.CTS_B
  uart5.RTS_B
  epdc.PWRCTRL[1]
  epdc.PWRCTRL[2]
  epdc.PWRCTRL[3]
  epdc.SDCE[4]
  epdc.SDCE[5]
  epdc.SDCE[6]
  epdc.SDCE[7]
  epdc.SDCE[8]
  epdc.SDCE[9]
  epdc.SDOED
  epdc.SDOEZ
  epdc.SDDO[8]
  epdc.SDDO[9]
  epdc.SDDO[10]
  epdc.SDDO[11]
  epdc.SDDO[12]
  epdc.SDDO[13]
  epdc.SDDO[14]
  epdc.SDDO[15]
  epdc.SDCLK
  epdc.SDLE
  epdc.SDOE
  epdc.SDCE[0]
  epdc.GDOE
  epdc.SDDO[0]
  epdc.SDDO[1]
  epdc.SDDO[2]
  epdc.SDDO[3]
  epdc.SDDO[4]
  epdc.SDDO[5]
  epdc.SDDO[6]
  epdc.SDDO[7]
  epdc.PWRIRQ
  epdc.PWRWAKE
  epdc.PWRCOM
  epdc.PWRSTAT
  epdc.PWRCTRL[0]
  epdc.BDR[0]
  epdc.SDSHR
  epdc.GDRL
  epdc.GDCLK
  epdc.GDSP
  epdc.BDR[1]
  epdc.VCOM[0]
  epdc.VCOM[1]
  epdc.SDCE[1]
  epdc.SDCE[2]
  epdc.SDCE[3]
  esai.TX3_RX2
  esai.TX2_RX3
  esai.TX4_RX1
  esai.TX1
  esai.TX_HF_CLK
  esai.RX_HF_CLK
  esai.RX_FS
  esai.RX_CLK
  esai.TX_FS
  esai.TX_CLK
  esai.TX5_RX0
  esai.TX0
- 100K PD
  100K PU
  100K PU
  100K PU
  100K PD
  100K PD
  100K PD
  Keeper
  Keeper
  Keeper
  Keeper
  Keeper
  Keeper
  Keeper
  Keeper
  Keeper
  Keeper
  100K PU
  47K PU
  100K PU
  47K PU
  47K PU
  47K PU
  Keeper
  Keeper
  Keeper
  Keeper
  Keeper
  Keeper
  Keeper
  Keeper
  Keeper
  Keeper
  Keeper
  Keeper
  Keeper
  Keeper
  Keeper
  Keeper
  Keeper
  Keeper
  Keeper
  Keeper
  Keeper
  Keeper
  Keeper
  Keeper
  Keeper
  Keeper
  Keeper
  Keeper
  Keeper
  Keeper
  Keeper
  Keeper
  Keeper
  Keeper
  Keeper
  Keeper
  Keeper
  Keeper
  Keeper
  Keeper
  Keeper
  Keeper
  Keeper
  Keeper
  Keeper
  Keeper
  Keeper
  Keeper
  Keeper
  Keeper
  Keeper
  Keeper
  Keeper
  Keeper
  Keeper
  Keeper
  Keeper
  Keeper
  Keeper
  Keeper
  Keeper
  Keeper
  Keeper
  Keeper
  Keeper
  Keeper
  Keeper
  Keeper
  Keeper
  Keeper
  Keeper
  Keeper
  Keeper
  Keeper
  Keeper
  Keeper
  Keeper
  Keeper
  Keeper
  Keeper
  Keeper
  Keeper
  Keeper
  Keeper
  Keeper
  Keeper
  Keeper
  Keeper
  Keeper
  Keeper
  Keeper
  Keeper
  Keeper
  Keeper
  Keeper
  Keeper
  Keeper
  Keeper
  Keeper
  Keeper
  Keeper
  Keeper
  Keeper
  Keeper
  Keeper
  Keeper
- (in symbol TitleBlock_FS) ICAP Classification:; CP:; IUO:; PUBI:; Drawing Title:; Page Title:; Size; Document Number; Rev; Date:; Sheet; of

### Library data of the parts
*#12 = TitleBlock_FS: OrgAddr2: Austin, TX 78735-8598; OrgAddr1: 6501 William Cannon Drive West; OrgName: Freescale Semiconductor; FCP: ___; Page Create Date: March  8, 1995; Page Count: 13; Page Modify Date: *

## Nets that join several sheets
DRAM_1V35: C-02 LvDDR3 (46 pins), C-07 PWR MGR (R728.2)
GND: C-01 CPU PWR (67 pins), C-02 LvDDR3 (58 pins), C-03 eMMC_NAND_TF_QSPI (22 pins), C-04 CPU PERI1 (21 pins), C-05 CPU PERI2 (16 pins), C-06 BOOT CFG (24 pins), C-07 PWR MGR (68 pins)
NVCC_3V3: C-03 eMMC_NAND_TF_QSPI (7 pins), C-04 CPU PERI1 (6 pins), C-05 CPU PERI2 (R512.1 R513.1 R517.2 U101.H13), C-06 BOOT CFG (24 pins), C-07 PWR MGR (13 pins)
NVCC_CSI: C-04 CPU PERI1 (C404.1 U101.F4), C-07 PWR MGR (R703.2 R704.2)
NVCC_NAND: C-03 eMMC_NAND_TF_QSPI (12 pins), C-04 CPU PERI1 (C403.1 U101.E7), C-07 PWR MGR (R701.2 R702.2)
NVCC_SD: C-04 CPU PERI1 (C405.1 R402.1 R403.1 U101.C4), C-07 PWR MGR (7 pins)
VDD_ARM_SOC_IN: C-01 CPU PWR (10 pins), C-07 PWR MGR (R729.2)
VDD_HIGH_CAP: C-01 CPU PWR (C119.1 C120.1 U101.R14 U101.R15), C-02 LvDDR3 (C201.1 U101.N6)
VDD_HIGH_IN: C-01 CPU PWR (C117.1 C118.1 U101.N13), C-07 PWR MGR (R732.2)
VDD_SNVS_3V3: C-01 CPU PWR (D102.2), C-07 PWR MGR (7 pins)
VDD_SNVS_IN: C-01 CPU PWR (5 pins), C-05 CPU PERI2 (R519.1), C-06 BOOT CFG (R625.2 R626.2)
VDDA_ADC_3P3: C-04 CPU PERI1 (C410.1 C411.1 U101.L13 U101.M13), C-07 PWR MGR (R705.2 R709.2)
BOOT_MODE0: C-05 CPU PERI2 (U101.T10), C-06 BOOT CFG (R655.1 SW602.2)
BOOT_MODE1: C-05 CPU PERI2 (U101.U10), C-06 BOOT CFG (R656.1 SW602.1)
GPIO_5: C-04 CPU PERI1 (U101.M17), C-07 PWR MGR (Q703.2 R725.1)
LCD_DATA0: C-04 CPU PERI1 (U101.B9), C-06 BOOT CFG (R630.1 R631.2 SW601.1)
LCD_DATA1: C-04 CPU PERI1 (U101.A9), C-06 BOOT CFG (R623.1 R632.2)
LCD_DATA2: C-04 CPU PERI1 (U101.E10), C-06 BOOT CFG (R622.1 R633.2)
LCD_DATA3: C-04 CPU PERI1 (U101.D10), C-06 BOOT CFG (R621.1 R634.2)
LCD_DATA4: C-04 CPU PERI1 (U101.C10), C-06 BOOT CFG (R620.1 R635.2)
LCD_DATA5: C-04 CPU PERI1 (U101.B10), C-06 BOOT CFG (R629.1 R636.2 SW601.2)
LCD_DATA6: C-04 CPU PERI1 (U101.A10), C-06 BOOT CFG (R628.1 R637.2 SW601.3)
LCD_DATA7: C-04 CPU PERI1 (U101.D11), C-06 BOOT CFG (R627.1 R638.2 SW601.4)
LCD_DATA8: C-04 CPU PERI1 (U101.B11), C-06 BOOT CFG (R616.1 R639.2)
LCD_DATA9: C-04 CPU PERI1 (U101.A11), C-06 BOOT CFG (R615.1 R640.2)
LCD_DATA10: C-04 CPU PERI1 (U101.E12), C-06 BOOT CFG (R614.1 R641.2)
LCD_DATA11: C-04 CPU PERI1 (U101.D12), C-06 BOOT CFG (R613.1 R642.2)
LCD_DATA12: C-04 CPU PERI1 (U101.C12), C-06 BOOT CFG (R612.1 R643.2)
LCD_DATA13: C-04 CPU PERI1 (U101.B12), C-06 BOOT CFG (R611.1 R644.2)
LCD_DATA14: C-04 CPU PERI1 (U101.A12), C-06 BOOT CFG (R610.1 R645.2)
LCD_DATA15: C-04 CPU PERI1 (U101.D13), C-06 BOOT CFG (R609.1 R646.2)
LCD_DATA16: C-04 CPU PERI1 (U101.C13), C-06 BOOT CFG (R608.1 R647.2)
LCD_DATA17: C-04 CPU PERI1 (U101.B13), C-06 BOOT CFG (R607.1 R648.2)
LCD_DATA18: C-04 CPU PERI1 (U101.A13), C-06 BOOT CFG (R606.1 R649.2)
LCD_DATA19: C-04 CPU PERI1 (U101.D14), C-06 BOOT CFG (R605.1 R650.2)
LCD_DATA20: C-04 CPU PERI1 (U101.C14), C-06 BOOT CFG (R604.1 R651.2)
LCD_DATA21: C-04 CPU PERI1 (U101.B14), C-06 BOOT CFG (R603.1 R652.2)
LCD_DATA22: C-04 CPU PERI1 (U101.A14), C-06 BOOT CFG (R602.1 R653.2)
LCD_DATA23: C-04 CPU PERI1 (U101.B16), C-06 BOOT CFG (R601.1 R654.2)
NAND_ALE: C-03 eMMC_NAND_TF_QSPI (R301.1 U301.K5), C-04 CPU PERI1 (R412.2)
NAND_DATA0: C-03 eMMC_NAND_TF_QSPI (U301.A3), C-04 CPU PERI1 (U101.D7)
NAND_DATA1: C-03 eMMC_NAND_TF_QSPI (U301.A4), C-04 CPU PERI1 (U101.B7)
NAND_DATA2: C-03 eMMC_NAND_TF_QSPI (U301.A5), C-04 CPU PERI1 (U101.A7)
NAND_DATA3: C-03 eMMC_NAND_TF_QSPI (U301.B2), C-04 CPU PERI1 (U101.D6)
NAND_DATA4: C-03 eMMC_NAND_TF_QSPI (U301.B3), C-04 CPU PERI1 (U101.C6)
NAND_DATA5: C-03 eMMC_NAND_TF_QSPI (U301.B4), C-04 CPU PERI1 (U101.B6)
NAND_DATA6: C-03 eMMC_NAND_TF_QSPI (U301.B5), C-04 CPU PERI1 (U101.A6)
NAND_DATA7: C-03 eMMC_NAND_TF_QSPI (U301.B6), C-04 CPU PERI1 (U101.A5)
NAND_nRE: C-03 eMMC_NAND_TF_QSPI (U301.M6), C-04 CPU PERI1 (C415.2 R406.2)
NAND_nWE: C-03 eMMC_NAND_TF_QSPI (U301.M5), C-04 CPU PERI1 (R407.2)
nWDOG: C-04 CPU PERI1 (R404.2), C-07 PWR MGR (C738.1)
PMIC_ON_REQ: C-05 CPU PERI2 (U101.T9), C-07 PWR MGR (Q704.2 R733.2)
PMIC_STBY_REQ: C-05 CPU PERI2 (Q501.2 U101.U9), C-07 PWR MGR (Q701.2 R714.1)
SNVS_TAMPER3: C-05 CPU PERI2 (U101.P10), C-07 PWR MGR (Q702.2 R715.1)